# EAGLE design adc-rtc-shield (EAGLE 6.4)
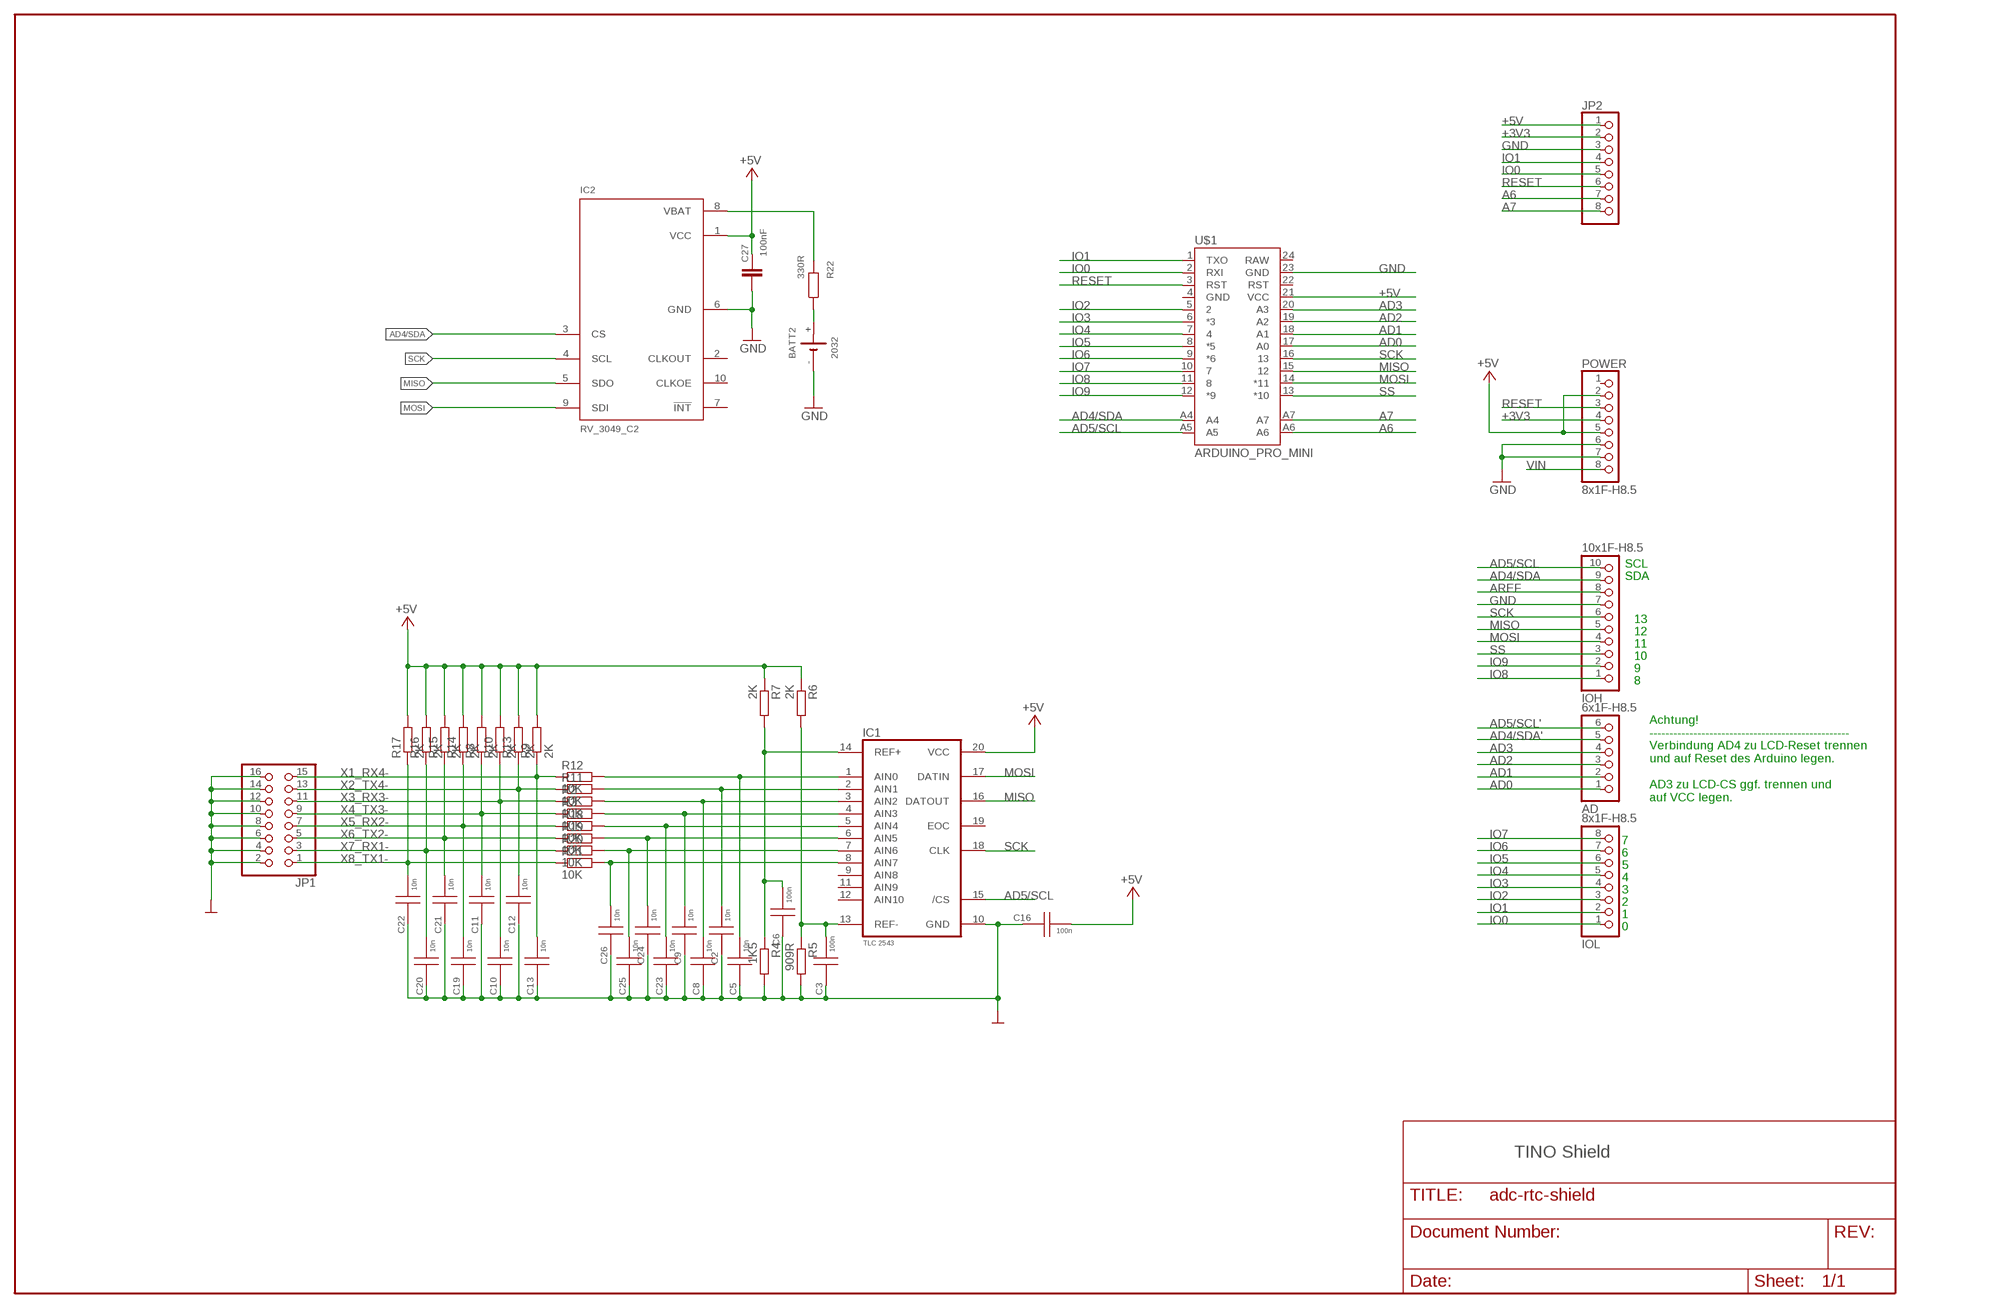
[diagram p0: schematic, sheet 1]

## Parts
AD  6x1F-H8.5  PINHD-1X6  [1X06]
BATT2  2032  CR2032_HOLDSMD  [2032_SMD]
C2  10n  C_KER  [0805-C]
C3  100n  C_KER  [0805-C]
C5  10n  C_KER  [0805-C]
C6  100n  C_KER  [0805-C]
C8  10n  C_KER  [0805-C]
C9  10n  C_KER  [0805-C]
C10  10n  C_KER  [0805-C]
C11  10n  C_KER  [0805-C]
C12  10n  C_KER  [0805-C]
C13  10n  C_KER  [0805-C]
C16  100n  C_KER  [0805-C]
C19  10n  C_KER  [0805-C]
C20  10n  C_KER  [0805-C]
C21  10n  C_KER  [0805-C]
C22  10n  C_KER  [0805-C]
C23  10n  C_KER  [0805-C]
C24  10n  C_KER  [0805-C]
C25  10n  C_KER  [0805-C]
C26  10n  C_KER  [0805-C]
C27  100nF  C-EUC0603  [C0603]
IC1  TLC2543  [DIL_20]
IC2  RV_3049_C2  [5X3.2_10]
IOH  10x1F-H8.5  PINHD-1X10_ARD  [1X10]
IOL  8x1F-H8.5  PINHD-1X8  [1X08]
JP1  PINHD-2X8/90  [2X08/90]
JP2  PINHD-1X8/90  [1X08/90]
POWER  8x1F-H8.5  PINHD-1X8  [1X08]
R2  10K  R-EU_R0603  [R0603]
R3  10K  R-EU_R0603  [R0603]
R4  1K5  R-EU_R0603  [R0603]
R5  909R  R-EU_R0603  [R0603]
R6  2K  R-EU_R0603  [R0603]
R7  2K  R-EU_R0603  [R0603]
R8  2K  R-EU_R0603  [R0603]
R9  2K  R-EU_R0603  [R0603]
R10  2K  R-EU_R0603  [R0603]
R11  10K  R-EU_R0603  [R0603]
R12  10K  R-EU_R0603  [R0603]
R13  2K  R-EU_R0603  [R0603]
R14  2K  R-EU_R0603  [R0603]
R15  2K  R-EU_R0603  [R0603]
R16  2K  R-EU_R0603  [R0603]
R17  2K  R-EU_R0603  [R0603]
R18  10K  R-EU_R0603  [R0603]
R19  10K  R-EU_R0603  [R0603]
R20  10K  R-EU_R0603  [R0603]
R21  10K  R-EU_R0603  [R0603]
R22  330R  R-EU_R0603  [R0603]
U$1  ARDUINO_PRO_MINI  [ARDUINO_PRO_MINI]

## Nets
+3V3: JP2.2 POWER.4
+5V [usbvcc]: C16.2 C27.1 IC1.20(VCC) IC2.1(VCC) JP2.1 POWER.2 POWER.5 R6.1 R7.1 R8.2 R9.2 R10.2 R13.2 R14.2 R15.2 R16.2 R17.2 U$1.21(VCC)
+BAT: BATT2.+ R22.1
A6: JP2.7 U$1.A6
A7: JP2.8 U$1.A7
AD0: AD.1 U$1.17(A0)
AD1: AD.2 U$1.18(A1)
AD2: AD.3 U$1.19(A2)
AD3: AD.4 U$1.20(A3)
AD4/SDA: IC2.3(CS) IOH.9 U$1.A4
AD4/SDA': AD.5
AD5/SCL: IC1.15(/CS) IOH.10 U$1.A5
AD5/SCL': AD.6
AREF [aref]: IOH.8
GND [gnd]: BATT2.- C2.1 C3.1 C5.1 C6.1 C8.1 C9.1 C10.1 C11.1 C12.1 C13.1 C16.1 C19.1 C20.1 C21.1 C22.1 C23.1 C24.1 C25.1 C26.1 C27.2 IC1.10(GND) IC2.6(GND) IOH.7 JP1.2 JP1.4 JP1.6 JP1.8 JP1.10 JP1.12 JP1.14 JP1.16 JP2.3 POWER.6 POWER.7 R4.2 R5.2 U$1.23(GND)
IO0: IOL.1 JP2.5 U$1.2(RXI)
IO1: IOL.2 JP2.4 U$1.1(TXO)
IO2: IOL.3 U$1.5
IO3: IOL.4 U$1.6(*3)
IO4: IOL.5 U$1.7
IO5: IOL.6 U$1.8(*5)
IO6: IOL.7 U$1.9(*6)
IO7: IOL.8 U$1.10
IO8: IOH.1 U$1.11
IO9: IOH.2 U$1.12(*9)
MISO: IC1.16(DATOUT) IC2.5(SDO) IOH.5 U$1.15
MOSI: IC1.17(DATIN) IC2.9(SDI) IOH.4 U$1.14(*11)
N$10: C3.2 IC1.13(REF-) R5.1 R6.2
N$11: C6.2 IC1.14(REF+) R4.1 R7.2
N$16: C2.2 IC1.2(AIN1) R11.2
N$17: C8.2 IC1.3(AIN2) R2.2
N$18: C9.2 IC1.4(AIN3) R3.2
N$19: C5.2 IC1.1(AIN0) R12.2
N$20: C23.2 IC1.5(AIN4) R18.2
N$21: C24.2 IC1.6(AIN5) R19.2
N$22: C25.2 IC1.7(AIN6) R20.2
N$23: C26.2 IC1.8(AIN7) R21.2
N$25: IC2.8(VBAT) R22.2
RESET: JP2.6 POWER.3 U$1.3(RST)
SCK: IC1.18(CLK) IC2.4(SCL) IOH.6 U$1.16
SS: IOH.3 U$1.13(*10)
VIN [power]: POWER.8
X1_RX4-: C13.2 JP1.15 R9.1 R12.1
X2_TX4-: C12.2 JP1.13 R11.1 R13.1
X3_RX3-: C10.2 JP1.11 R2.1 R10.1
X4_TX3-: C11.2 JP1.9 R3.1 R8.1
X5_RX2-: C19.2 JP1.7 R14.1 R18.1
X6_TX2-: C21.2 JP1.5 R15.1 R19.1
X7_RX1-: C20.2 JP1.3 R16.1 R20.1
X8_TX1-: C22.2 JP1.1 R17.1 R21.1
Unconnected: IC1.9(AIN8) IC1.11(AIN9) IC1.12(AIN10) IC1.19(EOC) IC2.2(CLKOUT) IC2.7(!INT) IC2.10(CLKOE) POWER.1 U$1.4(GND) U$1.22(RST) U$1.24(RAW)

## Notes on the sheet
- SCL
- SDA
- 13
- 12
- 11
- 10
- 9
- 8
- Achtung!
  --------------------------------------------------
  Verbindung AD4 zu LCD-Reset trennen
  und auf Reset des Arduino legen.
  
  AD3 zu LCD-CS ggf. trennen und
  auf VCC legen.
- 7
- 6
- 5
- 4
- 3
- 2
- 1
- 0
- TINO Shield

## Library data of the parts
AD = SmartPrj:PINHD-1X6: PIN HEADER
BATT2 = El_Mech:CR2032_HOLD: Batteriehalter 2032; BESCHREIBUNG: Batteriehalter SMD; HERSTELLER: z.B. Würth; HERST_NR: z.B. 795 271 41; SIZE: 2032
C2 C3 C5 C6 C8-C13 C16 C19-C26 = Passiv:C_KER
C27 = rcl:C-EU: CAPACITOR, European symbol; BESCHREIBUNG: Keramik Vielschichtkondensator; HERSTELLER: Div.; TK: X7R; TOL: 20%; VOLT: 16V
IC1 = HL_IC1:TLC2543
IC2 = RTC_Quarz:RV_3049_C2: Real Time Clock Module with SPI-Bus; BESCHREIBUNG: Real Time Clock Module with SPI-Bus; HERSTELLER: Micro Crystal CH
IOH = SmartPrj:PINHD-1X10_ARD: PIN HEADER
IOL POWER = SmartPrj:PINHD-1X8: PIN HEADER
JP1 = pinhead:PINHD-2X8: PIN HEADER
JP2 = pinhead:PINHD-1X8: PIN HEADER
R2-R21 = resistor:R-EU_: RESISTOR, European symbol
R22 = rcl:R-EU_: RESISTOR, European symbol; BESCHREIBUNG: Widerstand; HERSTELLER: Div.; LEISTUNG: 1/10W; TK: 100; TOL: 1%; VOLT: 50V
U$1 = SparkFun-Boards:ARDUINO_PRO_MINI

## Net classes
0 default: width 0.254 mm, clearance 0.254 mm
1 power: width 0.61 mm, drill 0.61 mm, clearance 0.254 mm
2 gnd: width 0.305 mm, drill 0.559 mm, clearance 0.254 mm
3 usbvcc: width 0.508 mm, drill 0.61 mm, clearance 0.254 mm
4 aref: width 0.406 mm, drill 0.61 mm, clearance 0.254 mm

## Board
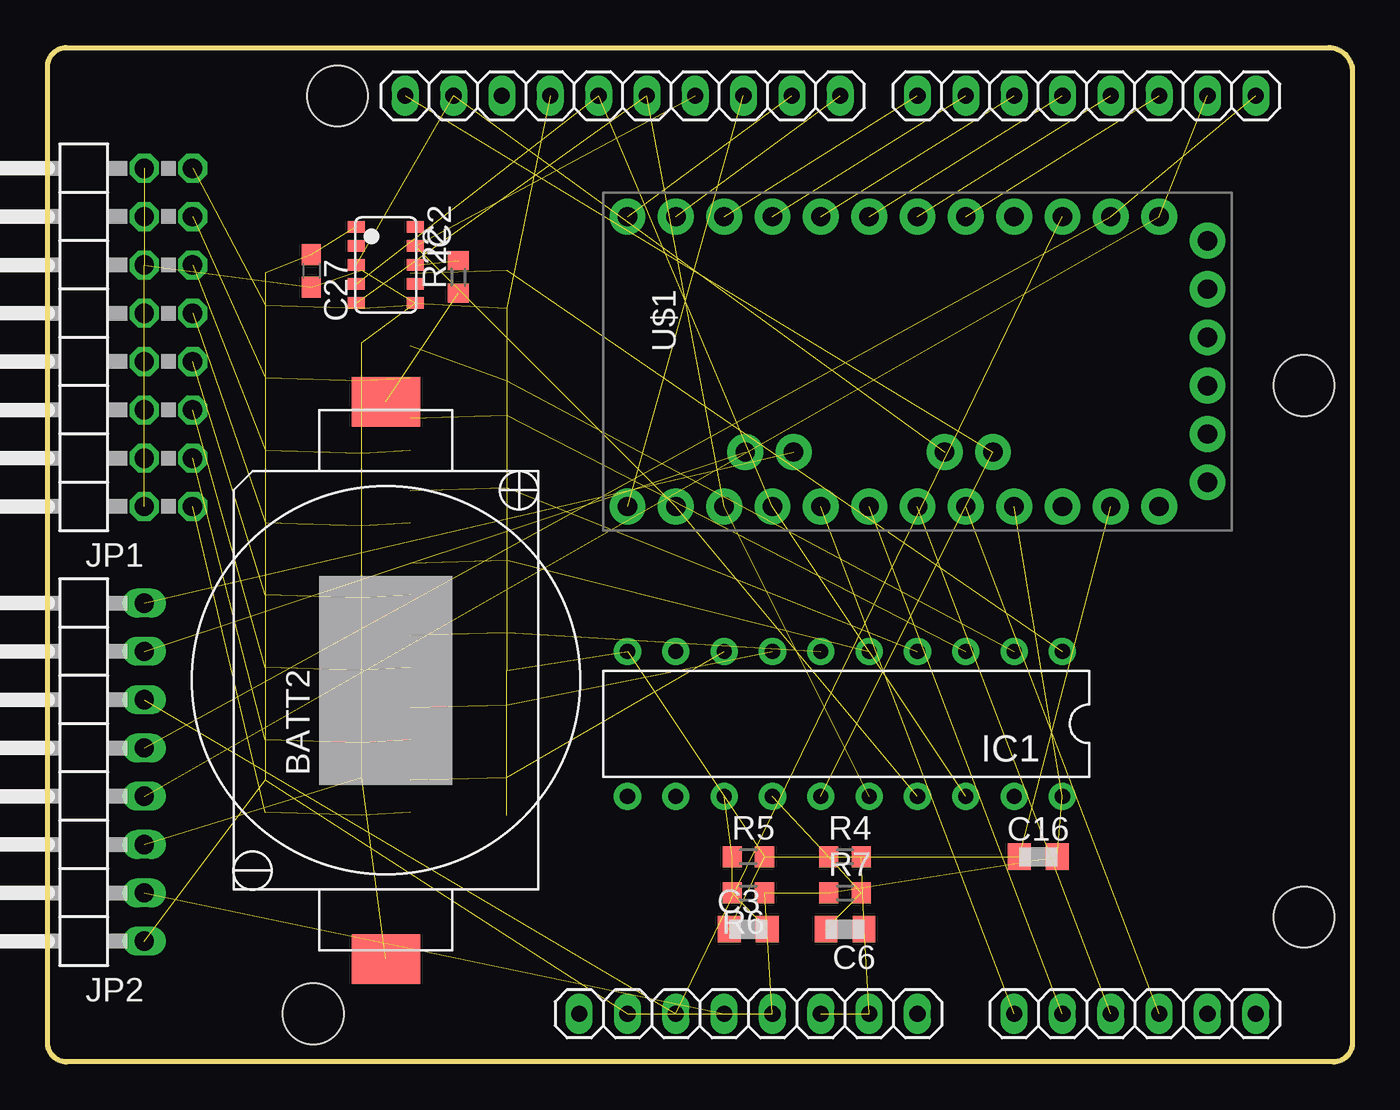
[diagram p1: board, top side]
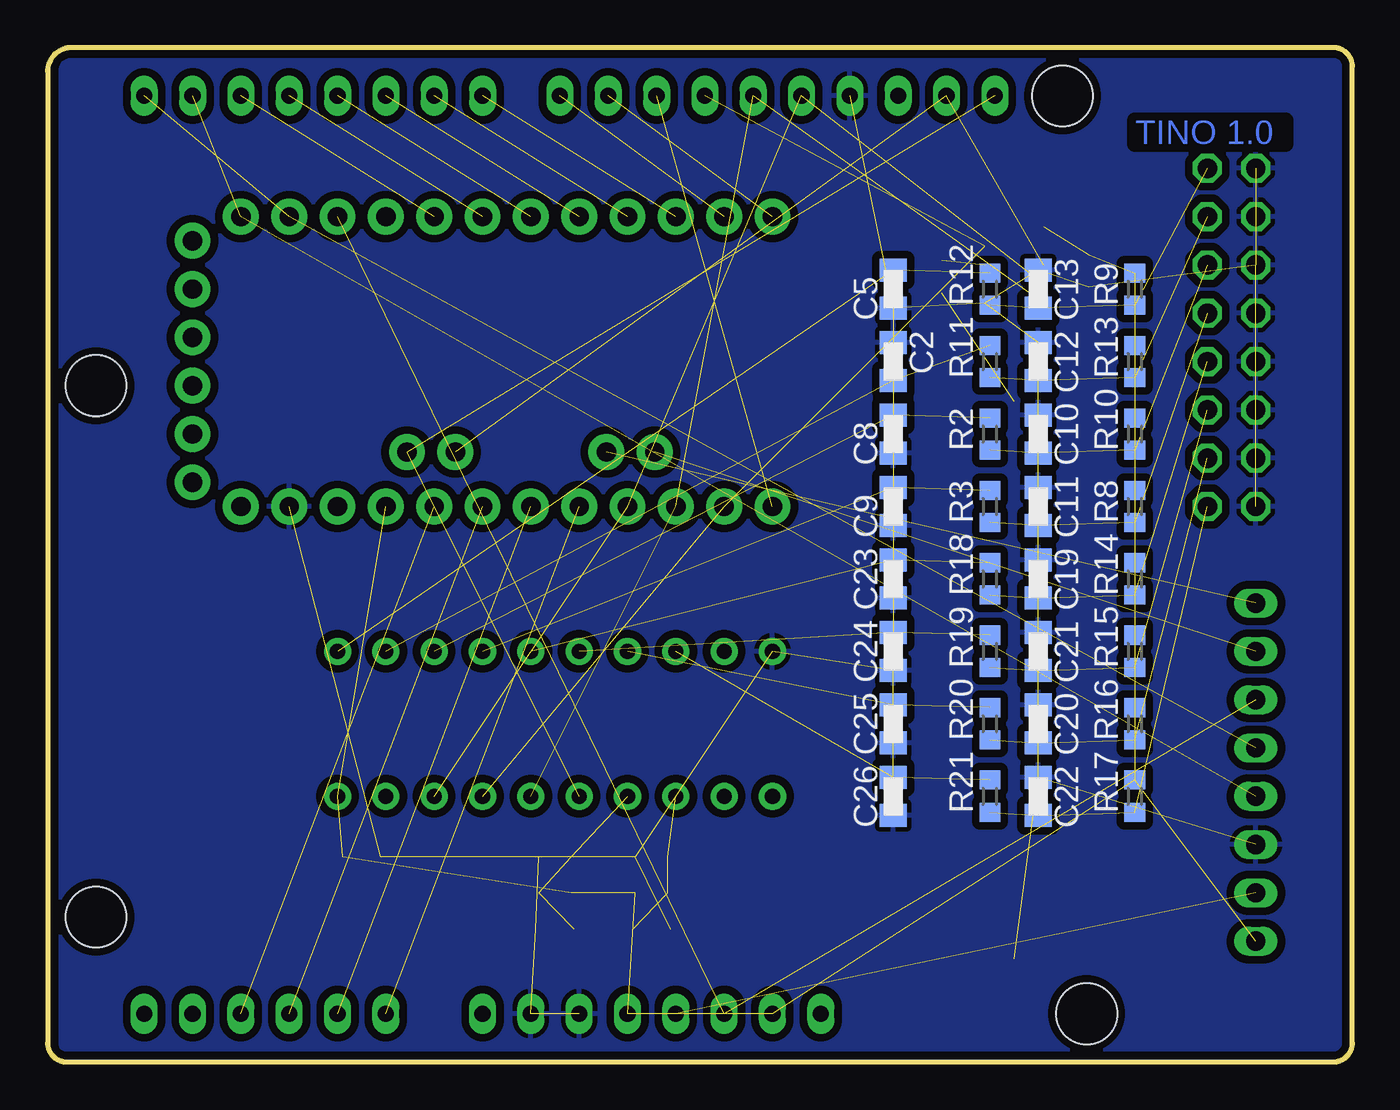
[diagram p2: board, bottom side, seen from below]

Size 68.58 x 53.34 mm. Coordinates in mm from the lower left corner, seen from the top.
Outline: 1,53.34 67.31,53.34 arc-90 68.58,52.07 68.58,1 arc-90 67.58,0 1,0 arc-90 0,1 0,52.34 arc-90 1,53.34
Copper layers (1*16): Top 0.035mm / dielectric 1.5mm / Bottom 0.035mm
Design rules "Elecrow_2-layer_eagle_rule *": minimum track width 6mil, minimum drill 12mil, track to track 6mil, track to pad 6mil, pad to pad 6mil, via to via 6mil, smd to smd 0mil, copper to edge 10mil, drill to drill 10mil, minimum pad ring 10mil, minimum via ring 6mil, stop-mask expansion 2mil, vias tented up to drill 100mil, thermal gap 10mil
Holes 3.2 mm at 66.04,35.56 66.04,7.62 15.24,50.8 13.97,2.54

### Footprints (pad centres in the part's own frame; a part is rotated, then mirrored left to right if it is on the bottom)
1X06 = drill 0.85 pad 1.422 long: 1 -6.35,0; 2 -3.81,0; 3 -1.27,0; 4 1.27,0; 5 3.81,0; 6 6.35,0
2032_SMD = smd 3.6 x 2.6: + 0,-14.65; - 0,14.65
0805-C = smd 1.2 x 1.4: 1 -1,0; 2 1,0
C0603 = smd 1.1 x 1: 1 -0.85,0; 2 0.85,0
DIL_20 = drill 0.8 pad 1.422: 1 0,0; 2 2.54,0; 3 5.08,0; 4 7.62,0; 5 10.16,0; 6 12.7,0; 7 15.24,0; 8 17.78,0; 9 20.32,0; 10 22.86,0; 11 22.86,7.62; 12 20.32,7.62; 13 17.78,7.62; 14 15.24,7.62; 15 12.7,7.62; 16 10.16,7.62; 17 7.62,7.62; 18 5.08,7.62; 19 2.54,7.62; 20 0,7.62
5X3.2_10 = smd 0.6 x 0.9: 1 -2,-1.55; 2 -1,-1.55; 3 0,-1.55; 4 1,-1.55; 5 2,-1.55; 6 2,1.55; 7 1,1.55; 8 0,1.55; 9 -1,1.55; 10 -2,1.55
1X10@1 = drill 0.85 pad 1.422 long: 1 -11.43,0; 2 -8.89,0; 3 -6.35,0; 4 -3.81,0; 5 -1.27,0; 6 1.27,0; 7 3.81,0; 8 6.35,0; 9 8.89,0; 10 11.43,0
1X08 = drill 0.85 pad 1.422 long: 1 -8.89,0; 2 -6.35,0; 3 -3.81,0; 4 -1.27,0; 5 1.27,0; 6 3.81,0; 7 6.35,0; 8 8.89,0
2X08/90 = drill 1.016 octagon: 1 -8.89,-6.35; 2 -8.89,-3.81; 3 -6.35,-6.35; 4 -6.35,-3.81; 5 -3.81,-6.35; 6 -3.81,-3.81; 7 -1.27,-6.35; 8 -1.27,-3.81; 9 1.27,-6.35; 10 1.27,-3.81; 11 3.81,-6.35; 12 3.81,-3.81; 13 6.35,-6.35; 14 6.35,-3.81; 15 8.89,-6.35; 16 8.89,-3.81
1X08/90 = drill 1.016 long: 1 -8.89,-3.81; 2 -6.35,-3.81; 3 -3.81,-3.81; 4 -1.27,-3.81; 5 1.27,-3.81; 6 3.81,-3.81; 7 6.35,-3.81; 8 8.89,-3.81
R0603 = smd 1 x 1.1: 1 -0.85,0; 2 0.85,0
ARDUINO_PRO_MINI = drill 1.016 pad 1.88: 1 -7.62,12.7; 2 -7.62,10.16; 3 -7.62,7.62; 4 -7.62,5.08; 5 -7.62,2.54; 6 -7.62,0; 7 -7.62,-2.54; 8 -7.62,-5.08; 9 -7.62,-7.62; 10 -7.62,-10.16; 11 -7.62,-12.7; 12 -7.62,-15.24; 13 7.62,-15.24; 14 7.62,-12.7; 15 7.62,-10.16; 16 7.62,-7.62; 17 7.62,-5.08; 18 7.62,-2.54; 19 7.62,0; 20 7.62,2.54; 21 7.62,5.08; 22 7.62,7.62; 23 7.62,10.16; 24 7.62,12.7; A4 4.763,1.429; A5 4.763,3.969; A6 4.763,-9.049; A7 4.763,-6.509; BLK -6.35,15.24; GND -3.81,15.24; GRN 6.35,15.24; RXI 1.27,15.24; TXO 3.81,15.24; VCC -1.27,15.24

### Placement (x,y rotation side)
AD  57.15,2.54 0 top
BATT2  17.78,20.07 180 top
C2  24.13,36.83 270 bottom
C3  36.83,6.99 0 top
C5  24.13,40.64 90 bottom
C6  41.91,6.99 180 top
C8  24.13,33.02 90 bottom
C9  24.13,29.21 90 bottom
C10  16.51,33.02 270 bottom
C11  16.51,29.21 270 bottom
C12  16.51,36.83 270 bottom
C13  16.51,40.64 270 bottom
C16  52.07,10.79 0 top
C19  16.51,25.4 270 bottom
C20  16.51,17.78 270 bottom
C21  16.51,21.59 270 bottom
C22  16.51,13.97 270 bottom
C23  24.13,25.4 90 bottom
C24  24.13,21.59 90 bottom
C25  24.13,17.78 90 bottom
C26  24.13,13.97 90 bottom
C27  13.87,41.6 270 top
IC1  53.34,21.59 180 top
IC2  17.78,41.91 270 top
IOH  10x1F-H8.5  [1X10@1]  30.23,50.8 180 top
IOL  54.61,50.8 180 top
JP1  1.27,38.1 90 top
JP2  1.27,15.24 90 top
POWER  36.83,2.54 0 top
R2  19.05,33.02 90 bottom
R3  19.05,29.21 90 bottom
R4  41.91,10.79 0 top
R5  36.83,10.79 0 top
R6  36.83,8.89 180 top
R7  41.91,8.89 0 top
R8  11.43,29.21 90 bottom
R9  11.43,40.64 90 bottom
R10  11.43,33.02 90 bottom
R11  19.05,36.83 90 bottom
R12  19.05,40.64 90 bottom
R13  11.43,36.83 90 bottom
R14  11.43,25.4 90 bottom
R15  11.43,21.59 90 bottom
R16  11.43,17.78 90 bottom
R17  11.43,13.97 90 bottom
R18  19.05,25.4 90 bottom
R19  19.05,21.59 90 bottom
R20  19.05,17.78 90 bottom
R21  19.05,13.97 90 bottom
R22  21.59,41.27 90 top
U$1  45.72,36.83 270 top

### Tracks (layer width: path | path; a pad name or v marks a point on that pad's centre or on a via)
+3V3  (1 unrouted)
+5V  (17 unrouted)
+BAT  (1 unrouted)
A6  (1 unrouted)
A7  (1 unrouted)
AD0  (1 unrouted)
AD1  (1 unrouted)
AD2  (1 unrouted)
AD3  (1 unrouted)
AD4/SDA  (2 unrouted)
AD5/SCL  (2 unrouted)
GND  (37 unrouted)
  pour Bottom (isolate 0.406, rank 2): 0.64,53.98 67.94,53.98 67.94,0.64 0.89,0.64 0.64,0.89
IO0  (2 unrouted)
IO1  (2 unrouted)
IO2  (1 unrouted)
IO3  (1 unrouted)
IO4  (1 unrouted)
IO5  (1 unrouted)
IO6  (1 unrouted)
IO7  (1 unrouted)
IO8  (1 unrouted)
IO9  (1 unrouted)
MISO  (3 unrouted)
MOSI  (3 unrouted)
N$10  (3 unrouted)
N$11  (3 unrouted)
N$16  (2 unrouted)
N$17  (2 unrouted)
N$18  (2 unrouted)
N$19  (2 unrouted)
N$20  (2 unrouted)
N$21  (2 unrouted)
N$22  (2 unrouted)
N$23  (2 unrouted)
N$25  (1 unrouted)
RESET  (2 unrouted)
SCK  (3 unrouted)
SS  (1 unrouted)
X1_RX4-  (3 unrouted)
X2_TX4-  (3 unrouted)
X3_RX3-  (3 unrouted)
X4_TX3-  (3 unrouted)
X5_RX2-  (3 unrouted)
X6_TX2-  (3 unrouted)
X7_RX1-  (3 unrouted)
X8_TX1-  (3 unrouted)

### Text on the board
Bottom: TINO 1.0
214bmp: D:/SmartProjects/Snc/a4_bn_logo2.bmp